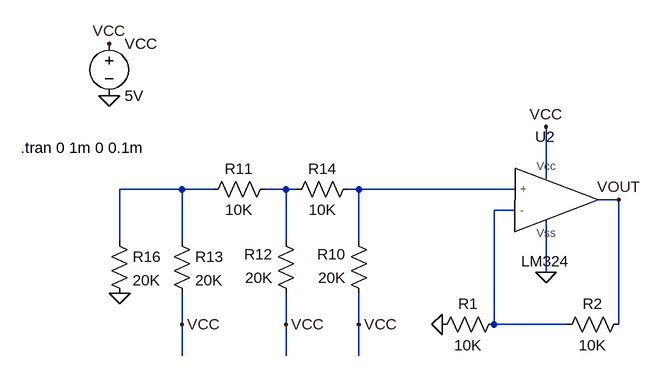
[diagram p0: schematic BAI 8 THUC HANH 2.asc]
BAI 8 THUC HANH 2.asc, the LTspice schematic file:
Version 4.1
SHEET 1 880 680
WIRE 304 -16 304 -96
WIRE -256 0 -352 0
WIRE -208 0 -256 0
WIRE -96 0 -128 0
WIRE -80 0 -96 0
WIRE 16 0 0 0
WIRE 256 0 16 0
WIRE 416 16 384 16
WIRE 256 32 224 32
WIRE -352 80 -352 0
WIRE -256 80 -256 0
WIRE -96 80 -96 0
WIRE 16 80 16 0
WIRE 304 128 304 48
WIRE -256 208 -256 160
WIRE -96 208 -96 160
WIRE 16 208 16 160
WIRE 224 208 224 32
WIRE 336 208 224 208
WIRE 416 208 416 16
WIRE -256 256 -256 208
WIRE -96 256 -96 208
WIRE 16 256 16 208
FLAG 304 -96 VCC
FLAG 416 16 VOUT
FLAG 144 208 0
FLAG -352 160 0
FLAG -256 208 VCC
FLAG -368 -224 VCC
FLAG -368 -144 0
FLAG -96 208 VCC
FLAG 16 208 VCC
FLAG 304 128 0
SYMBOL res 432 192 R90
WINDOW 0 0 56 VBottom 2
WINDOW 3 32 56 VTop 2
SYMATTR InstName R2
SYMATTR Value 10K
SYMBOL res 240 192 R90
WINDOW 0 0 56 VBottom 2
WINDOW 3 32 56 VTop 2
SYMATTR InstName R1
SYMATTR Value 10K
SYMBOL res 16 -16 R90
WINDOW 0 0 56 VBottom 2
WINDOW 3 32 56 VTop 2
SYMATTR InstName R14
SYMATTR Value 10K
SYMBOL res 32 176 R180
WINDOW 0 36 76 Left 2
WINDOW 3 36 40 Left 2
SYMATTR InstName R10
SYMATTR Value 20K
SYMBOL res -224 16 R270
WINDOW 0 32 56 VTop 2
WINDOW 3 0 56 VBottom 2
SYMATTR InstName R11
SYMATTR Value 10K
SYMBOL res -80 176 R180
WINDOW 0 36 76 Left 2
WINDOW 3 36 40 Left 2
SYMATTR InstName R12
SYMATTR Value 20K
SYMBOL res -272 64 R0
SYMATTR InstName R13
SYMATTR Value 20K
SYMBOL res -368 64 R0
SYMATTR InstName R16
SYMATTR Value 20K
SYMBOL LM324 304 16 R0
SYMATTR InstName U2
SYMBOL voltage -368 -240 R0
WINDOW 123 0 0 Left 0
WINDOW 39 0 0 Left 0
SYMATTR InstName VCC
SYMATTR Value 5V
TEXT -504 -64 Left 2 !.tran 0 1m 0 0.1m

The netlist it stands for:
* BAI 8 THUC HANH 2.asc
R2 VOUT N004 10K
R1 N004 0 10K
R14 N003 N002 10K
R10 VCC N003 20K
R11 N001 N002 10K
R12 VCC N002 20K
R13 N001 VCC 20K
R16 N001 0 20K
X§U2 N003 N004 VCC 0 VOUT LM324  ; pins + - Vcc Vss ?
VCC VCC 0 5V
.tran 0 1m 0 0.1m
.lib E:\ThiThucHanhCoHa\CoHa\LM324.cir
.backanno
.end